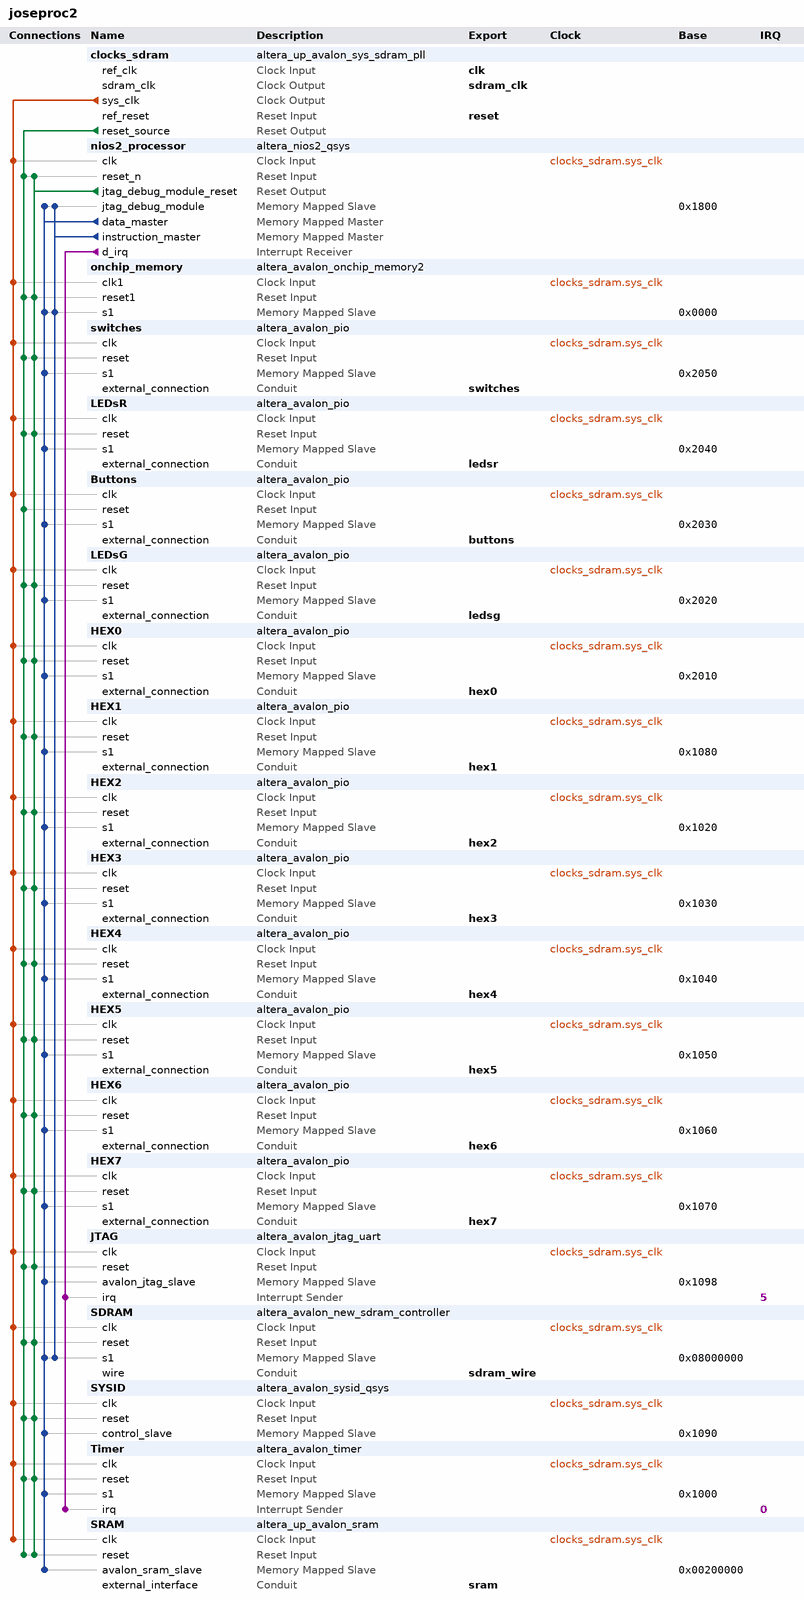
[diagram p0: system contents]
# Platform Designer (Qsys) system joseproc2, Cyclone IV E EP4CE115F29C7
# Parameters at their usual value, and those the tool derives, are not listed.
package require -exact qsys 17.1
create_system joseproc2
set_project_property DEVICE_FAMILY {Cyclone IV E}
set_project_property DEVICE EP4CE115F29C7

add_instance clocks_sdram altera_up_avalon_sys_sdram_pll 17.1
set_instance_parameter_value clocks_sdram CV_boards DE10-Standard
set_instance_parameter_value clocks_sdram gui_outclk 50.0
set_instance_parameter_value clocks_sdram gui_refclk 50.0

add_instance nios2_processor altera_nios2_qsys 16.1
set_instance_parameter_value nios2_processor breakSlave nios2_processor.jtag_debug_module
set_instance_parameter_value nios2_processor exceptionSlave SDRAM.s1
set_instance_parameter_value nios2_processor icache_size 4096
set_instance_parameter_value nios2_processor impl Tiny
set_instance_parameter_value nios2_processor mmu_TLBMissExcSlave None
set_instance_parameter_value nios2_processor resetSlave SDRAM.s1
set_instance_parameter_value nios2_processor resetrequest_enabled true

add_instance onchip_memory altera_avalon_onchip_memory2 17.1
set_instance_parameter_value onchip_memory dataWidth 32
set_instance_parameter_value onchip_memory dualPort false
set_instance_parameter_value onchip_memory initMemContent true
set_instance_parameter_value onchip_memory initializationFileName onchip_mem.hex
set_instance_parameter_value onchip_memory memorySize 4096

add_instance switches altera_avalon_pio 17.1
set_instance_parameter_value switches direction Input
set_instance_parameter_value switches width 18

add_instance LEDsR altera_avalon_pio 17.1
set_instance_parameter_value LEDsR direction Output
set_instance_parameter_value LEDsR width 18

add_instance Buttons altera_avalon_pio 17.1
set_instance_parameter_value Buttons captureEdge true
set_instance_parameter_value Buttons direction Input
set_instance_parameter_value Buttons edgeType FALLING
set_instance_parameter_value Buttons generateIRQ true
set_instance_parameter_value Buttons irqType EDGE
set_instance_parameter_value Buttons width 4

add_instance LEDsG altera_avalon_pio 17.1
set_instance_parameter_value LEDsG direction Output
set_instance_parameter_value LEDsG width 8

add_instance HEX0 altera_avalon_pio 17.1
set_instance_parameter_value HEX0 direction Output
set_instance_parameter_value HEX0 width 8

add_instance HEX1 altera_avalon_pio 17.1
set_instance_parameter_value HEX1 direction Output
set_instance_parameter_value HEX1 width 8

add_instance HEX2 altera_avalon_pio 17.1
set_instance_parameter_value HEX2 direction Output
set_instance_parameter_value HEX2 width 8

add_instance HEX3 altera_avalon_pio 17.1
set_instance_parameter_value HEX3 direction Output
set_instance_parameter_value HEX3 width 8

add_instance HEX4 altera_avalon_pio 17.1
set_instance_parameter_value HEX4 direction Output
set_instance_parameter_value HEX4 width 8

add_instance HEX5 altera_avalon_pio 17.1
set_instance_parameter_value HEX5 direction Output
set_instance_parameter_value HEX5 width 8

add_instance HEX6 altera_avalon_pio 17.1
set_instance_parameter_value HEX6 direction Output
set_instance_parameter_value HEX6 width 8

add_instance HEX7 altera_avalon_pio 17.1
set_instance_parameter_value HEX7 direction Output
set_instance_parameter_value HEX7 width 8

add_instance JTAG altera_avalon_jtag_uart 17.1
set_instance_parameter_value JTAG simInteractiveOptions NO_INTERACTIVE_WINDOWS

add_instance SDRAM altera_avalon_new_sdram_controller 17.1
set_instance_parameter_value SDRAM TAC 5.4
set_instance_parameter_value SDRAM TRCD 15.0
set_instance_parameter_value SDRAM TRP 15.0
set_instance_parameter_value SDRAM casLatency 3
set_instance_parameter_value SDRAM columnWidth 10
set_instance_parameter_value SDRAM dataWidth 32
set_instance_parameter_value SDRAM generateSimulationModel false
set_instance_parameter_value SDRAM model single_Micron_MT48LC4M32B2_7_chip
set_instance_parameter_value SDRAM numberOfBanks 4
set_instance_parameter_value SDRAM numberOfChipSelects 1
set_instance_parameter_value SDRAM powerUpDelay 100.0
set_instance_parameter_value SDRAM refreshPeriod 7.8125
set_instance_parameter_value SDRAM rowWidth 13

add_instance SYSID altera_avalon_sysid_qsys 17.1
set_instance_parameter_value SYSID id 0

add_instance Timer altera_avalon_timer 17.1
set_instance_parameter_value Timer period 1
set_instance_parameter_value Timer periodUnits MSEC

add_instance SRAM altera_up_avalon_sram 17.1
set_instance_parameter_value SRAM board DE2-115
set_instance_parameter_value SRAM pixel_buffer false

# connections
add_connection clocks_sdram.sys_clk Buttons.clk clock
add_connection clocks_sdram.sys_clk HEX0.clk clock
add_connection clocks_sdram.sys_clk HEX1.clk clock
add_connection clocks_sdram.sys_clk HEX2.clk clock
add_connection clocks_sdram.sys_clk HEX3.clk clock
add_connection clocks_sdram.sys_clk HEX4.clk clock
add_connection clocks_sdram.sys_clk HEX5.clk clock
add_connection clocks_sdram.sys_clk HEX6.clk clock
add_connection clocks_sdram.sys_clk HEX7.clk clock
add_connection clocks_sdram.sys_clk JTAG.clk clock
add_connection clocks_sdram.sys_clk LEDsG.clk clock
add_connection clocks_sdram.sys_clk LEDsR.clk clock
add_connection clocks_sdram.sys_clk nios2_processor.clk clock
add_connection clocks_sdram.sys_clk onchip_memory.clk1 clock
add_connection clocks_sdram.sys_clk SDRAM.clk clock
add_connection clocks_sdram.sys_clk SRAM.clk clock
add_connection clocks_sdram.sys_clk switches.clk clock
add_connection clocks_sdram.sys_clk SYSID.clk clock
add_connection clocks_sdram.sys_clk Timer.clk clock
add_connection clocks_sdram.reset_source Buttons.reset reset
add_connection clocks_sdram.reset_source HEX0.reset reset
add_connection clocks_sdram.reset_source HEX1.reset reset
add_connection clocks_sdram.reset_source HEX2.reset reset
add_connection clocks_sdram.reset_source HEX3.reset reset
add_connection clocks_sdram.reset_source HEX4.reset reset
add_connection clocks_sdram.reset_source HEX5.reset reset
add_connection clocks_sdram.reset_source HEX6.reset reset
add_connection clocks_sdram.reset_source HEX7.reset reset
add_connection clocks_sdram.reset_source JTAG.reset reset
add_connection clocks_sdram.reset_source LEDsG.reset reset
add_connection clocks_sdram.reset_source LEDsR.reset reset
add_connection clocks_sdram.reset_source nios2_processor.reset_n reset
add_connection clocks_sdram.reset_source onchip_memory.reset1 reset
add_connection clocks_sdram.reset_source SDRAM.reset reset
add_connection clocks_sdram.reset_source SRAM.reset reset
add_connection clocks_sdram.reset_source switches.reset reset
add_connection clocks_sdram.reset_source SYSID.reset reset
add_connection clocks_sdram.reset_source Timer.reset reset
add_connection nios2_processor.jtag_debug_module_reset HEX0.reset reset
add_connection nios2_processor.jtag_debug_module_reset HEX1.reset reset
add_connection nios2_processor.jtag_debug_module_reset HEX2.reset reset
add_connection nios2_processor.jtag_debug_module_reset HEX3.reset reset
add_connection nios2_processor.jtag_debug_module_reset HEX4.reset reset
add_connection nios2_processor.jtag_debug_module_reset HEX5.reset reset
add_connection nios2_processor.jtag_debug_module_reset HEX6.reset reset
add_connection nios2_processor.jtag_debug_module_reset HEX7.reset reset
add_connection nios2_processor.jtag_debug_module_reset JTAG.reset reset
add_connection nios2_processor.jtag_debug_module_reset LEDsG.reset reset
add_connection nios2_processor.jtag_debug_module_reset LEDsR.reset reset
add_connection nios2_processor.jtag_debug_module_reset nios2_processor.reset_n reset
add_connection nios2_processor.jtag_debug_module_reset onchip_memory.reset1 reset
add_connection nios2_processor.jtag_debug_module_reset SDRAM.reset reset
add_connection nios2_processor.jtag_debug_module_reset SRAM.reset reset
add_connection nios2_processor.jtag_debug_module_reset switches.reset reset
add_connection nios2_processor.jtag_debug_module_reset SYSID.reset reset
add_connection nios2_processor.jtag_debug_module_reset Timer.reset reset
add_connection nios2_processor.data_master Buttons.s1 avalon
set_connection_parameter_value nios2_processor.data_master/Buttons.s1 baseAddress 0x2030
add_connection nios2_processor.data_master HEX0.s1 avalon
set_connection_parameter_value nios2_processor.data_master/HEX0.s1 baseAddress 0x2010
add_connection nios2_processor.data_master HEX1.s1 avalon
set_connection_parameter_value nios2_processor.data_master/HEX1.s1 baseAddress 0x1080
add_connection nios2_processor.data_master HEX2.s1 avalon
set_connection_parameter_value nios2_processor.data_master/HEX2.s1 baseAddress 0x1020
add_connection nios2_processor.data_master HEX3.s1 avalon
set_connection_parameter_value nios2_processor.data_master/HEX3.s1 baseAddress 0x1030
add_connection nios2_processor.data_master HEX4.s1 avalon
set_connection_parameter_value nios2_processor.data_master/HEX4.s1 baseAddress 0x1040
add_connection nios2_processor.data_master HEX5.s1 avalon
set_connection_parameter_value nios2_processor.data_master/HEX5.s1 baseAddress 0x1050
add_connection nios2_processor.data_master HEX6.s1 avalon
set_connection_parameter_value nios2_processor.data_master/HEX6.s1 baseAddress 0x1060
add_connection nios2_processor.data_master HEX7.s1 avalon
set_connection_parameter_value nios2_processor.data_master/HEX7.s1 baseAddress 0x1070
add_connection nios2_processor.data_master JTAG.avalon_jtag_slave avalon
set_connection_parameter_value nios2_processor.data_master/JTAG.avalon_jtag_slave baseAddress 0x1098
add_connection nios2_processor.data_master LEDsG.s1 avalon
set_connection_parameter_value nios2_processor.data_master/LEDsG.s1 baseAddress 0x2020
add_connection nios2_processor.data_master LEDsR.s1 avalon
set_connection_parameter_value nios2_processor.data_master/LEDsR.s1 baseAddress 0x2040
add_connection nios2_processor.data_master nios2_processor.jtag_debug_module avalon
set_connection_parameter_value nios2_processor.data_master/nios2_processor.jtag_debug_module baseAddress 0x1800
add_connection nios2_processor.data_master onchip_memory.s1 avalon
set_connection_parameter_value nios2_processor.data_master/onchip_memory.s1 baseAddress 0x0000
add_connection nios2_processor.data_master SDRAM.s1 avalon
set_connection_parameter_value nios2_processor.data_master/SDRAM.s1 baseAddress 0x08000000
add_connection nios2_processor.data_master SRAM.avalon_sram_slave avalon
set_connection_parameter_value nios2_processor.data_master/SRAM.avalon_sram_slave baseAddress 0x00200000
add_connection nios2_processor.data_master switches.s1 avalon
set_connection_parameter_value nios2_processor.data_master/switches.s1 baseAddress 0x2050
add_connection nios2_processor.data_master SYSID.control_slave avalon
set_connection_parameter_value nios2_processor.data_master/SYSID.control_slave baseAddress 0x1090
add_connection nios2_processor.data_master Timer.s1 avalon
set_connection_parameter_value nios2_processor.data_master/Timer.s1 baseAddress 0x1000
add_connection nios2_processor.instruction_master nios2_processor.jtag_debug_module avalon
set_connection_parameter_value nios2_processor.instruction_master/nios2_processor.jtag_debug_module baseAddress 0x1800
add_connection nios2_processor.instruction_master onchip_memory.s1 avalon
set_connection_parameter_value nios2_processor.instruction_master/onchip_memory.s1 baseAddress 0x0000
add_connection nios2_processor.instruction_master SDRAM.s1 avalon
set_connection_parameter_value nios2_processor.instruction_master/SDRAM.s1 baseAddress 0x08000000
add_connection nios2_processor.d_irq JTAG.irq interrupt
set_connection_parameter_value nios2_processor.d_irq/JTAG.irq irqNumber 5
add_connection nios2_processor.d_irq Timer.irq interrupt
set_connection_parameter_value nios2_processor.d_irq/Timer.irq irqNumber 0

# exported interfaces
add_interface buttons conduit end
set_interface_property buttons EXPORT_OF Buttons.external_connection
add_interface clk clock sink
set_interface_property clk EXPORT_OF clocks_sdram.ref_clk
add_interface hex0 conduit end
set_interface_property hex0 EXPORT_OF HEX0.external_connection
add_interface hex1 conduit end
set_interface_property hex1 EXPORT_OF HEX1.external_connection
add_interface hex2 conduit end
set_interface_property hex2 EXPORT_OF HEX2.external_connection
add_interface hex3 conduit end
set_interface_property hex3 EXPORT_OF HEX3.external_connection
add_interface hex4 conduit end
set_interface_property hex4 EXPORT_OF HEX4.external_connection
add_interface hex5 conduit end
set_interface_property hex5 EXPORT_OF HEX5.external_connection
add_interface hex6 conduit end
set_interface_property hex6 EXPORT_OF HEX6.external_connection
add_interface hex7 conduit end
set_interface_property hex7 EXPORT_OF HEX7.external_connection
add_interface ledsg conduit end
set_interface_property ledsg EXPORT_OF LEDsG.external_connection
add_interface ledsr conduit end
set_interface_property ledsr EXPORT_OF LEDsR.external_connection
add_interface reset reset sink
set_interface_property reset EXPORT_OF clocks_sdram.ref_reset
add_interface sdram_clk clock source
set_interface_property sdram_clk EXPORT_OF clocks_sdram.sdram_clk
add_interface sdram_wire conduit end
set_interface_property sdram_wire EXPORT_OF SDRAM.wire
add_interface sram conduit end
set_interface_property sram EXPORT_OF SRAM.external_interface
add_interface switches conduit end
set_interface_property switches EXPORT_OF switches.external_connection

set_interconnect_requirement {$system} qsys_mm.clockCrossingAdapter HANDSHAKE
set_interconnect_requirement {$system} qsys_mm.enableEccProtection FALSE
set_interconnect_requirement {$system} qsys_mm.insertDefaultSlave FALSE
set_interconnect_requirement {$system} qsys_mm.maxAdditionalLatency 1

save_system joseproc2.qsys
